# Altium schematic sheet led_RGB_schematic.SchDoc
size A
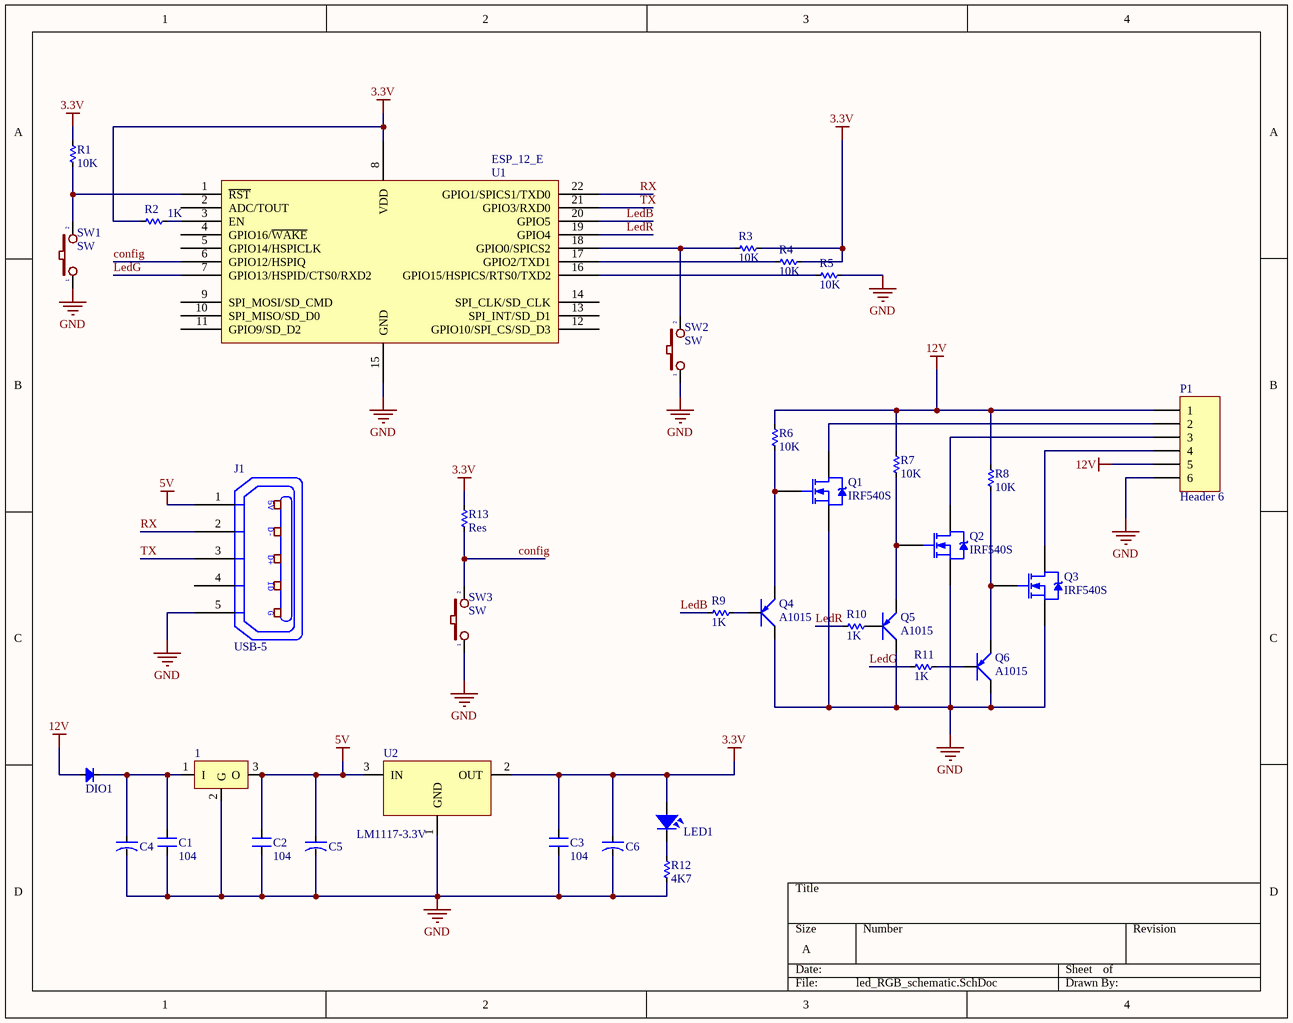
[diagram p0: led_RGB_schematic.SchDoc]

## Parts
1  LM78xx  [TO252-123]  (value not drawn)
C1  104  [SM-CAP-0805]
C2  104  [SM-CAP-0805]
C3  104  [SM-CAP-0805]
C4  CN-ALU-SMD  [CAP-ALU-SMD-4.5x5x1.4]  (value not drawn)
C5  CN-ALU-SMD  [CAP-ALU-SMD-4.5x5x1.4]  (value not drawn)
C6  CN-ALU-SMD  [CAP-ALU-SMD-4.5x5x1.4]  (value not drawn)
DIO1  Diode SMD  [DIO-SMD-106]  (value not drawn)
J1  USB-5  [USB-M1]
LED1  LED  [LED-0805-Blue]  (value not drawn)
P1  Header 6  [HED6T]
Q1  IRF540S  [D2PAK_N]
Q2  IRF540S  [D2PAK_N]
Q3  IRF540S  [D2PAK_N]
Q4  A1015  [SOT23B]
Q5  A1015  [SOT23B]
Q6  A1015  [SOT23B]
R1  10K  [RES-SMD-0805]
R2  1K  [RES-SMD-0805]
R3  10K  [RES-SMD-0805]
R4  10K  [RES-SMD-0805]
R5  10K  [RES-SMD-0805]
R6  10K  [RES-SMD-0805]
R7  10K  [RES-SMD-0805]
R8  10K  [RES-SMD-0805]
R9  1K  [RES-SMD-0805]
R10  1K  [RES-SMD-0805]
R11  1K  [RES-SMD-0805]
R12  4K7  [RES-SMD-0805]
R13  Res  [RES-SMD-0805]
SW1  SW  [SW1-SMD]
SW2  SW  [SW-DIP1-1]
SW3  SW  [SW2-D2]
U1  ESP_12_E  [ESP_12_E]
U2  LM1117-3.3V  [SOT223]

## Nets
3.3V: C3.2 C6.1 LED1.1 R1.1 R2.2 R3.1 R4.1 R13.1 U1.8(VDD) U2.2(OUT)
5V: 1.3(O) C2.2 C5.1 J1.1(P1) U2.3(IN)
12V: DIO1.1(A) P1.1 P1.5 R6.1 R7.1 R8.1
GND: 1.2(G) C1.1 C2.1 C3.1 C4.2 C5.2 C6.2 J1.5(P5) P1.6 Q1.3(S) Q2.3(S) Q3.3(S) Q4.2(C) Q5.2(C) Q6.2(C) R5.1 R12.2 SW1.1 SW2.1 SW3.1 U1.15(GND) U2.1(GND)
config: R13.2 SW3.2 U1.6(GPIO12/HSPIQ)
LedB: R9.1 U1.20(GPIO5)
LedG: R11.1 U1.7(GPIO13/HSPID/CTS0/RXD2)
LedR: R10.1 U1.19(GPIO4)
RX: J1.2(P2) U1.22(GPIO1/SPICS1/TXD0)
TX: J1.3(P3) U1.21(GPIO3/RXD0)
Net1_1: 1.1(I) C1.2 C4.1 DIO1.2(K)
NetLED1_2: LED1.2 R12.1
NetP1_2: P1.2 Q1.2(D)
NetP1_3: P1.3 Q2.2(D)
NetP1_4: P1.4 Q3.2(D)
NetQ1_1: Q1.1(G) Q4.1(E) R6.2
NetQ2_1: Q2.1(G) Q5.1(E) R7.2
NetQ3_1: Q3.1(G) Q6.1(E) R8.2
NetQ4_3: Q4.3(B) R9.2
NetQ5_3: Q5.3(B) R10.2
NetQ6_3: Q6.3(B) R11.2
NetR1_2: R1.2 SW1.2 U1.1(~{RST})
NetR2_1: R2.1 U1.3(EN)
NetR3_2: R3.2 SW2.2 U1.18(GPIO0/SPICS2)
NetR4_2: R4.2 U1.17(GPIO2/TXD1)
NetR5_2: R5.2 U1.16(GPIO15/HSPICS/RTS0/TXD2)

Not connected (* = marked no-connect by the designer): J1 4(P4); U1 2(ADC/TOUT) 4(GPIO16/~{WAKE}) 5(GPIO14/HSPICLK) 9(SPI_MOSI/SD_CMD) 10(SPI_MISO/SD_D0) 11(GPIO9/SD_D2) 12(GPIO10/SPI_CS/SD_D3) 13(SPI_INT/SD_D1) 14(SPI_CLK/SD_CLK)

## Notes on the sheet
- (in symbol USB-5) 5V; D-; D+; ID; G

## Library data of the parts
1 = LM78xx: Positive Voltage Regulator; Note: Tab is connected to pin 3 (GND).; Published: 24-Aug-2001; LatestRevisionDate: 17-Jul-2002; LatestRevisionNote: Re-released for DXP Platform.; DatasheetVersion: Apr-1994; PackageVersion: Jul-1998; PackageReference: ISOWATT220AB; Publisher: Altium Limited; PackageDescription: TO, Thru-Hole, Vertical, Heatsink Mounted; 3 In-Line Leads; Pitch 2.54 mm; Pin sequence 1, 3, 2; ComponentLink1Description: Manufacturer Link; ComponentLink1URL: http://www.st.com/; ComponentLink2Description: Datasheet; ComponentLink2URL: http://www.st.com/stonline/products/literature/ds/2146/l78m05c.pdf
C1-C3 = CN: Value: 0,1uF/300V; Designed by: VanDungEvn
C4-C6 = CN-ALU-SMD: Polarized Capacitor (Axial); Published: 8-Jun-2000; LatestRevisionDate: 17-Jul-2002; LatestRevisionNote: Re-released for DXP Platform.; PackageReference: POLAR0.8; Publisher: Altium Limited
DIO1 = Diode SMD: Default Diode; Code - JEDEC: DO-214-AB; Value: 1N5007; Published: 8-Jun-2000; Revision: July-2002: Re-released for DXP Platform.; Publisher: Altium Limited
J1 = USB-5: Manufacturer: FCI; Manufacturer Part Number: 10118193-0001LF; Connector Type: USB - micro B; Number of Contacts: 5; Gender: Receptacle; Specifications: USB 2.0; .Creator: MM; .Checked PCB: RF; Supplier 1: Digi-Key; RoHS: RoHS Compliant; Category: Connectors, Interconnects; Stock 1: 28642; Pricing 1: 1=0.46, 10=0.433, 25=0.3712, 50=0.3156, 100=0.3032, 250=0.27224, 500=0.25988 (USD); Packaging: Cut Tape (CT); Mounting Type: Surface Mount, Right Angle, Horizontal; Features: Shielded, Solder Retention; Ingress Protection: -; ComponentLink1URL: http://portal.fciconnect.com/Comergent//fci/drawing/10118193.pdf; ComponentLink1Description: http://portal.fciconnect.com/Comergent//fci/drawing/10118193.pdf; Supplier Part Number 1: 609-4616-1-ND; .Checked SCH: MM
LED1 = LED SMD: Value: LED 3 - 5 ly 2 Colour
P1 = Header 6: Header, 6-Pin; LatestRevisionDate: 17-Jul-2002; LatestRevisionNote: Re-released for DXP Platform.; Publisher: Altium Limited
Q1-Q3 = IRF540S: HEXFET N-Channel Power MOSFET; Published: 8-Jun-2000; LatestRevisionDate: 20-Nov-2009; LatestRevisionNote: IPC-7351 Footprint Added.; DatasheetVersion: PD-9.898; PackageReference: D2PAK; Publisher: Altium Limited; PackageDescription: 3-Pin Transistor Outline Package 2.54 mm Pitch, 15.1 mm Lead Span; ComponentLink1Description: Manufacturer Link; ComponentLink1URL: http://www.irf.com/; ComponentLink2Description: Datasheet; ComponentLink2URL: http://www.irf.com/product-info/datasheets/data/irf540s.pdf
Q4-Q6 = A1015: PNP 600mW, ECB; Value: A1015
R1-R13 = Res-SMD: Resistor; Manufacturer: Generic Components; Class: Passive; Published: 08/06/2000; Publisher: Altium Hobart Technology Centre
SW1-SW3 = SW2: Switch button 2 pin; Value: SW chip 2 pin
U1 = ESP_12_E: ESP-12 Wi-Fi Module by AI-Thinker; IC: ESP8266-EX; Vendor: Ai-thinker
U2 = LM1117: 800mA Low-Dropout Linear Regulator; Creator: Nguyen Ba Bien; Website: http://group3i.net